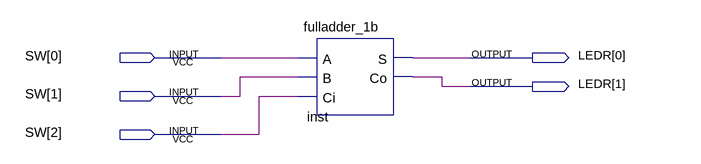
[diagram p0: schematic sheet]
// Quartus schematic top.bdf as structural Verilog: 1 symbols, 5 pins
module top (
  input  [2:0] SW,
  output [1:0] LEDR
);

  fulladder_1b inst (.A(SW[0]), .B(SW[1]), .Ci(SW[2]), .S(LEDR[0]), .Co(LEDR[1]));
endmodule
